# EAGLE design UV BOX (EAGLE 9.6.2)

## Sheet 1 of 6: Power Supply Unit
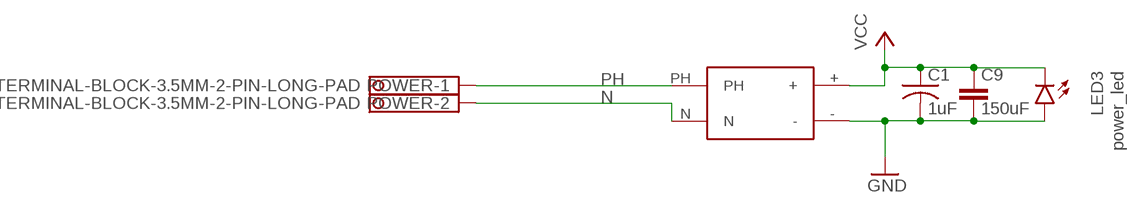
[diagram p0: schematic, sheet 1]

### Parts
C1  1uF  C-USC1206K  [C1206K]
C9  150uF  C5/5  [C5B5]
LED3  power_led  LEDCHIPLED_1206  [CHIPLED_1206]
POWER  TERMINAL-BLOCK-3.5MM-2-PIN-LONG-PAD  [TERMINAL-BLOCK-2-PIN-3.5MM-LONG-PAD]
U2  AC/DCCONVERTER  [ACDC]

### Nets
GND: C1.2 C9.2 LED3.A U2.- ; also sheet 2,3,4,5,6
N: POWER.2 U2.N ; also sheet 5
PH: POWER.1 U2.PH ; also sheet 5
VCC: C1.1 C9.1 LED3.C U2.+ ; also sheet 2,3,4,5,6

## Sheet 2 of 6: Indication LEDs
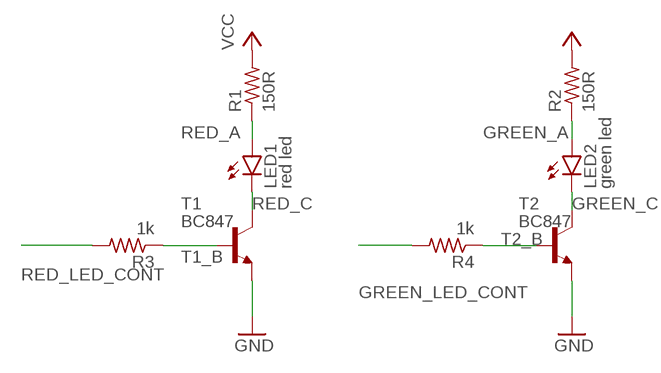
[diagram p1: schematic, sheet 2]

### Parts
LED1  red led  LEDCHIPLED_1206  [CHIPLED_1206]
LED2  green led  LEDCHIPLED_1206  [CHIPLED_1206]
R1  150R  R-US_R1206  [R1206]
R2  150R  R-US_R1206  [R1206]
R3  1k  R-US_R1206  [R1206]
R4  1k  R-US_R1206  [R1206]
T1  BC847  [SOT23]
T2  BC847  [SOT23]

### Nets
GND: T1.2(E) T2.2(E) ; also sheet 1,3,4,5,6
GREEN_A: LED2.A R2.1
GREEN_C: LED2.C T2.3(C)
GREEN_LED_CONT: R4.2 ; also sheet 6
RED_A: LED1.A R1.1
RED_C: LED1.C T1.3(C)
RED_LED_CONT: R3.2 ; also sheet 6
T1_B: R3.1 T1.1(B)
T2_B: R4.1 T2.1(B)
VCC: R1.2 R2.2 ; also sheet 1,3,4,5,6

## Sheet 3 of 6: Hooter System
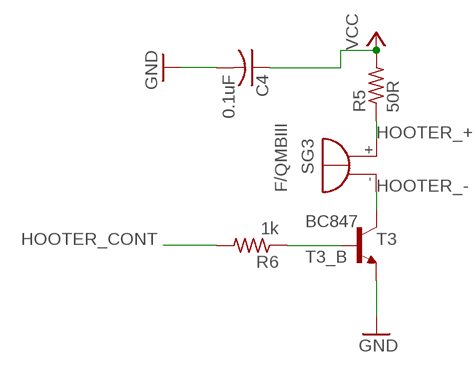
[diagram p2: schematic, sheet 3]

### Parts
C4  0.1uF  C-USC1206K  [C1206K]
R5  50R  R-US_R1206  [R1206]
R6  1k  R-US_R1206  [R1206]
SG3  F/QMBIII  [F/QMBIII]
T3  BC847  [SOT23]

### Nets
GND: C4.2 T3.2(E) ; also sheet 1,2,4,5,6
HOOTER_+: R5.1 SG3.+(-)
HOOTER_-: SG3.-(+) T3.3(C)
HOOTER_CONT: R6.2 ; also sheet 6
T3_B: R6.1 T3.1(B)
VCC: C4.1 R5.2 ; also sheet 1,2,4,5,6

## Sheet 4 of 6: Pushbutton
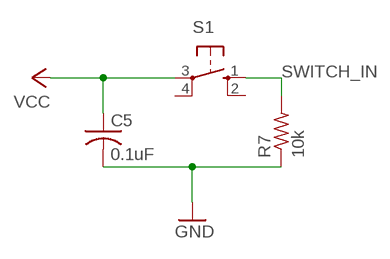
[diagram p3: schematic, sheet 4]

### Parts
C5  0.1uF  C-USC1206K  [C1206K]
R7  10k  R-US_R1206  [R1206]
S1  40-XX  [B3F-40XX]

### Nets
GND: C5.2 R7.1 ; also sheet 1,2,3,5,6
SWITCH_IN: R7.2 S1.1(S) ; also sheet 6
VCC: C5.1 S1.3(P) ; also sheet 1,2,3,5,6
Unconnected: S1.2(S1) S1.4(P1)

## Sheet 5 of 6: Relay and Limit Switch
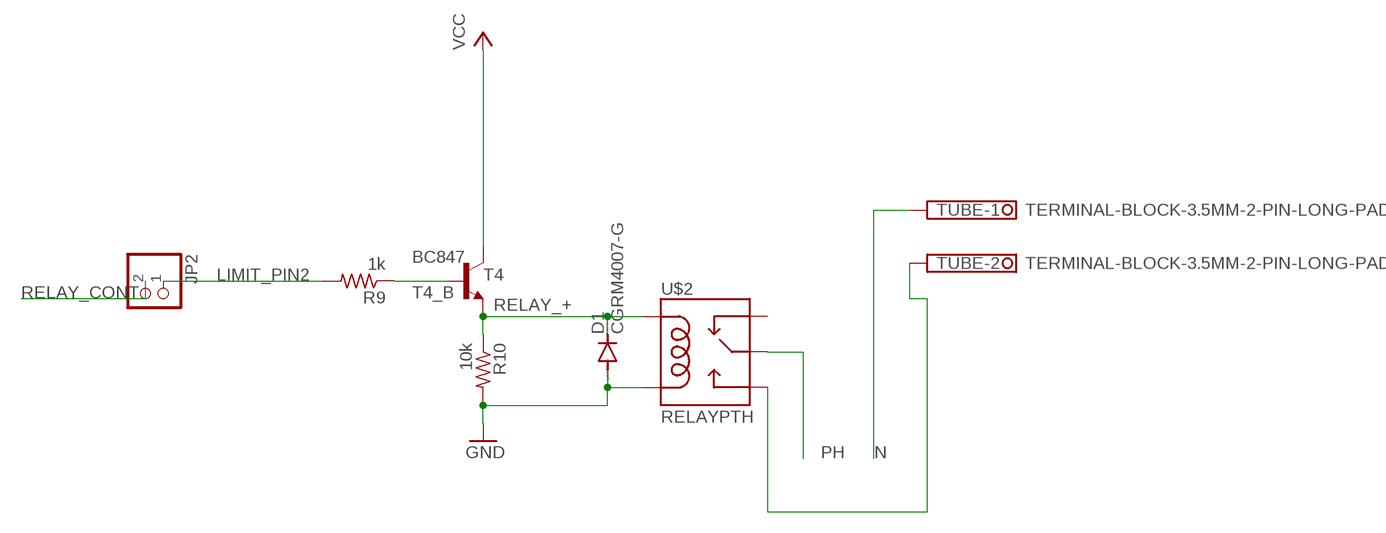
[diagram p4: schematic, sheet 5]

### Parts
D1  CGRM4007-G  [SOD-123_MINI-SMA]
JP2  PINHD-1X2  [1X02]
R9  1k  R-US_R1206  [R1206]
R10  10k  R-US_R1206  [R1206]
T4  BC847  [SOT23]
TUBE  TERMINAL-BLOCK-3.5MM-2-PIN-LONG-PAD  [TERMINAL-BLOCK-2-PIN-3.5MM-LONG-PAD]
U$2  RELAYPTH  [SRD-05VDC-SL-C]

### Nets
GND: D1.A R10.2 U$2.COIL0 ; also sheet 1,2,3,4,6
LIMIT_PIN2: JP2.1 R9.2
N: TUBE.1 ; also sheet 1
PH: U$2.SWCOMMON ; also sheet 1
RELAY_+: D1.C R10.1 T4.2(E) U$2.COIL1
RELAY_CONT: JP2.2 ; also sheet 6
T4_B: R9.1 T4.1(B)
TUBE_N: TUBE.2 U$2.SWOPEN
VCC: T4.3(C) ; also sheet 1,2,3,4,6
Unconnected: U$2.SWCLOSED(SWCLOSE)

## Sheet 6 of 6: controller
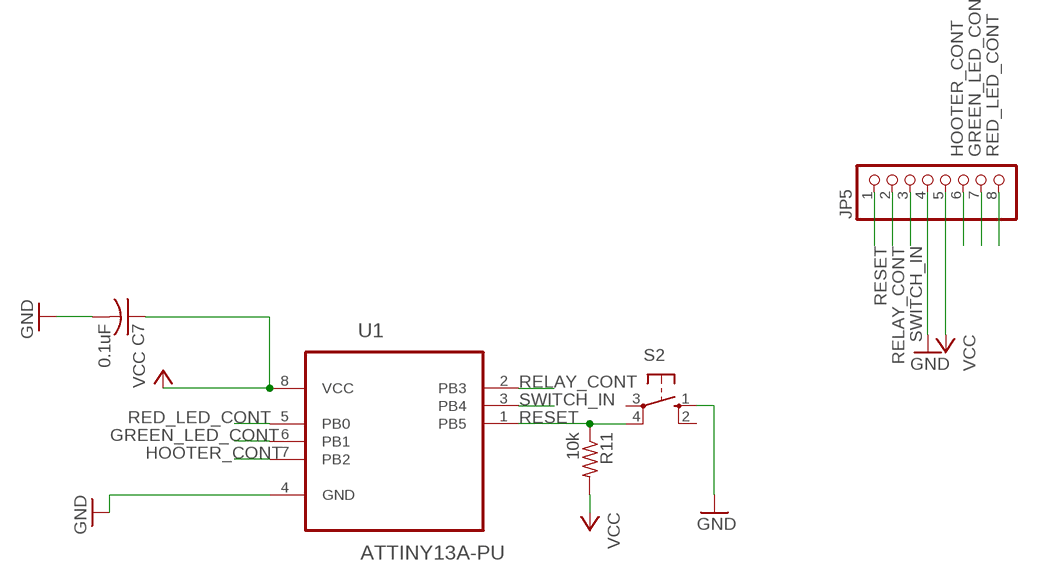
[diagram p5: schematic, sheet 6]

### Parts
C7  0.1uF  C-USC1206K  [C1206K]
JP5  PINHD-1X8  [1X08]
R11  10k  R-US_R1206  [R1206]
S2  10-XX  [B3F-10XX]
U1  ATTINY13A-PU  [DIP254P762X533-8]

### Nets
GND: C7.2 JP5.4 S2.1(S) U1.4(GND) ; also sheet 1,2,3,4,5
GREEN_LED_CONT: JP5.7 U1.6(PB1) ; also sheet 2
HOOTER_CONT: JP5.6 U1.7(PB2) ; also sheet 3
RED_LED_CONT: JP5.8 U1.5(PB0) ; also sheet 2
RELAY_CONT: JP5.2 U1.2(PB3) ; also sheet 5
RESET: JP5.1 R11.1 S2.4(P1) U1.1(PB5)
SWITCH_IN: JP5.3 U1.3(PB4) ; also sheet 4
VCC: C7.1 JP5.5 R11.2 U1.8(VCC) ; also sheet 1,2,3,4,5
Unconnected: S2.2(S1) S2.3(P)

## Library data of the parts
C1 C4 C5 C7 = rcl:C-US: CAPACITOR, American symbol; SPICEPREFIX: C
C9 = capacitor-wima:C: CAPACITOR naming: grid - package width
D1 = diode:CGRM400*-G: Molded plasitc,JEDEC SOD-123/Mini SMA Source: Comchip CGRM4001-G.pdf
JP2 = pinhead:PINHD-1X2: PIN HEADER
JP5 = pinhead:PINHD-1X8: PIN HEADER
LED1-LED3 = led:LED: LED OSRAM: - CHIPLED LG R971, LG N971, LY N971, LG Q971, LY Q971, LO R971, LY R971 LH N974, LH R974 LS Q976, LO Q976, LY Q976 LO Q996 - Hyper CHIPLED LW Q18S LB Q993, LB Q99A, LB R99A - SideLED LS A670, LO A670, LY A670, LG A670, LP A670 LB A673, LV A673, LT A673, LW A673 LH A674 LY A675 LS A676, LA A676, LO A676, LY A676, LW A676 LS A679, LY A679, LG A679 - Hyper Micro SIDELED® LS Y876, LA Y876, LO Y876, LY Y876 LT Y87S - SmartLED LW L88C, LW L88S LB L89C, LB L89S, LG L890 LS L89K, LO L89K, LY L89K LS L896, LA L896, LO L896, LY L896 - TOPLED LS T670, LO T670, LY T670, LG T670, LP T670 LSG T670, LSP T670, LSY T670, LOP T670, LYG T670 LG T671, LOG T671, LSG T671 LB T673, LV T673, LT T673, LW T673 LH T674 LS T676, LA T676, LO T676, LY T676, LB T676, LH T676, LSB T676, LW T676 LB T67C, LV T67C, LT T67C, LS T67K, LO T67K, LY T67K, LW E67C LS E67B, LA E67B, LO E67B, LY E67B, LB E67C, LV E67C, LT E67C LW T67C LS T679, LY T679, LG T679 LS T770, LO T770, LY T770, LG T770, LP T770 LB T773, LV T773, LT T773, LW T773 LH T774 LS E675, LA E675, LY E675, LS T675 LS T776, LA T776, LO T776, LY T776, LB T776 LHGB T686 LT T68C, LB T68C - Hyper Mini TOPLED® LB M676 - Mini TOPLED Santana® LG M470 LS M47K, LO M47K, LY M47K Source: http://www.osram.convergy.de LUXEON: - LUMILED® LXK2-PW12-R00, LXK2-PW12-S00, LXK2-PW14-U00, LXK2-PW14-V00 LXK2-PM12-R00, LXK2-PM12-S00, LXK2-PM14-U00 LXK2-PE12-Q00, LXK2-PE12-R00, LXK2-PE12-S00, LXK2-PE14-T00, LXK2-PE14-U00 LXK2-PB12-K00, LXK2-PB12-L00, LXK2-PB12-M00, LXK2-PB14-N00, LXK2-PB14-P00, LXK2-PB14-Q00 LXK2-PR12-L00, LXK2-PR12-M00, LXK2-PR14-Q00, LXK2-PR14-R00 LXK2-PD12-Q00, LXK2-PD12-R00, LXK2-PD12-S00 LXK2-PH12-R00, LXK2-PH12-S00 LXK2-PL12-P00, LXK2-PL12-Q00, LXK2-PL12-R00 Source: www.luxeon.com KINGBRIGHT: KA-3528ASYC Source: www.kingbright.com
POWER TUBE = Rembrandt Electronics - Terminal Block 3-5mm v1-0:TERMINAL-BLOCK-3.5MM-2-PIN: Terminal Block 3.5mm Pitch: 3,5 mm Number of pins: 2 Created by Rembrandt Electronics www.rembrandtelectronics.com
R1-R7 R9-R11 = rcl:R-US_: RESISTOR, American symbol; SPICEPREFIX: R
S1 = switch-omron:40-XX: OMRON SWITCH; MF: OMRON COMPONENTS USA; MPN: B3F-4000; OC_FARNELL: 176434; OC_NEWARK: 36K3105
S2 = switch-omron:10-XX: OMRON SWITCH; MPN: B3F-1000; OC_FARNELL: 176432; OC_NEWARK: 36M3542
SG3 = buzzer:F/QMBIII: BUZZER Source: Buerklin; OC_FARNELL: unknown; OC_NEWARK: unknown
T1-T4 = transistor:BC847: NPN TRANSISTOR
U1 = ATTINY13A-PU:ATTINY13A-PU: 8-bit Microcontroller with 1K Bytes In-System Programmable Flash Check prices <https://pricing.snapeda.com/parts/ATTINY13A-PU/Microchip/view-part?ref=eda>; AVAILABILITY: Good; DESCRIPTION: AVR AVR® ATtiny Microcontroller IC 8-Bit 20MHz 1KB (512 x 16) FLASH 8-PDIP; MF: Microchip; MP: ATTINY13A-PU; PACKAGE: PDIP-8 Microchip; PRICE: None; PURCHASE-URL: https://pricing.snapeda.com/search/part/ATTINY13A-PU/?ref=eda
U2 = ACDC_5V:AC/DCCONVERTER
U$2 = SRD-05VDC-SL-C:RELAY: SPDT relay (COM-00101)

## Net classes
0 default: width 0.152 mm, clearance 0.152 mm

## Board
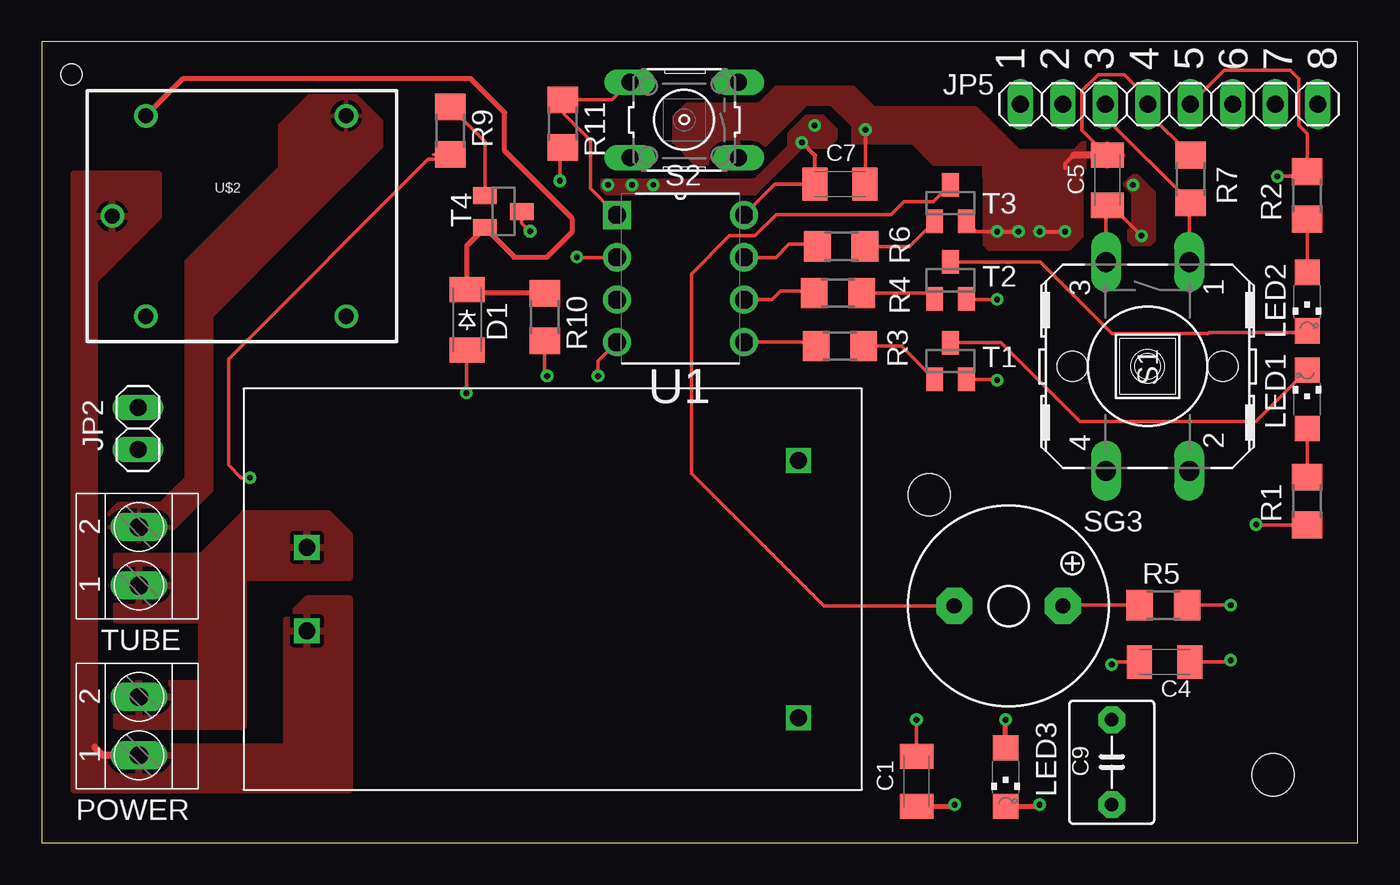
[diagram p6: board, top side]
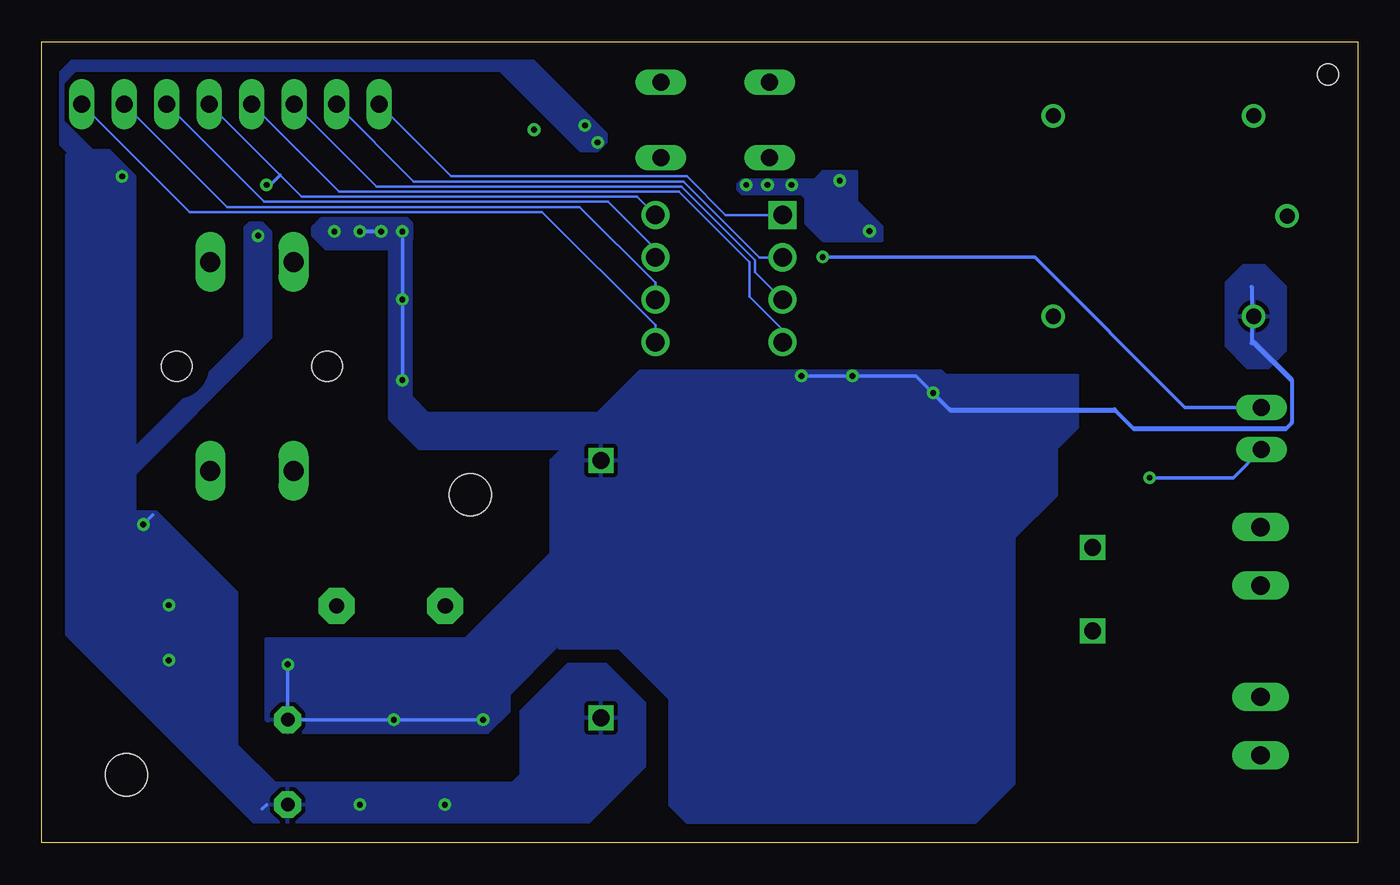
[diagram p7: board, bottom side, seen from below]

Size 78.72 x 47.93 mm. Coordinates in mm from the lower left corner, seen from the top.
Outline: 0,0 78.72,0 78.72,47.93 0,47.93 0,0
Copper layers (1*16): Top 0.035mm / dielectric 1.5mm / Bottom 0.035mm
Design rules "default *": minimum track width 6mil, minimum drill 0.35mm, track to track 6mil, track to pad 6mil, pad to pad 6mil, via to via 12mil, smd to smd 6mil, copper to edge 40mil, drill to drill 6mil, minimum pad ring 10mil, minimum via ring 8mil, stop-mask expansion 4mil, vias tented up to drill 0mil, thermal gap 10mil
Holes 2.51 mm at 53.09,20.83 73.66,4.06
Holes 1.27 mm at 1.78,45.97

### Footprints (pad centres in the part's own frame; a part is rotated, then mirrored left to right if it is on the bottom)
C1206K = smd 1.5 x 2: 1 -1.5,0; 2 1.5,0
C5B5 = drill 0.813 pad 1.6 octagon: 1 -2.54,0; 2 2.54,0
SOD-123_MINI-SMA = smd 1.5 x 2.1: A 1.8,0; C -1.8,0
1X02 = drill 1.016 long: 1 -1.27,0; 2 1.27,0
1X08 = drill 1.016 long: 1 -8.89,0; 2 -6.35,0; 3 -3.81,0; 4 -1.27,0; 5 1.27,0; 6 3.81,0; 7 6.35,0; 8 8.89,0
CHIPLED_1206 = smd 1.5 x 1.5: A 0,-1.75; C 0,1.75
TERMINAL-BLOCK-2-PIN-3.5MM-LONG-PAD = drill 1.1 pad 1.7 long: 1 -1.75,-0.1; 2 1.75,-0.1
R1206 = smd 1.6 x 1.803: 1 -1.422,0; 2 1.422,0
B3F-40XX = drill 1.194 long: 1 -6.248,2.489; 2 6.248,2.489; 3 -6.248,-2.489; 4 6.248,-2.489 | hole 1.803: 0,-4.496; 0,4.496
B3F-10XX = drill 1.016 long: 1 -3.251,2.261; 2 3.251,2.261; 3 -3.251,-2.261; 4 3.251,-2.261
F/QMBIII = drill 0.914 pad 2.159 octagon: + 3.251,0; - -3.251,0
SOT23 = smd 1 x 1.4: 1 -0.95,-1.1; 2 0.95,-1.1; 3 0,1.1
DIP254P762X533-8 = drill 1.118 square: 1 -7.62,7.62 | drill 1.118: 2 -7.62,5.08; 3 -7.62,2.54; 4 -7.62,0; 5 0,0; 6 0,2.54; 7 0,5.08; 8 0,7.62
ACDC = drill 1 square: + 33.2,4.3; - 33.2,19.7; N 3.8,14.5; PH 3.8,9.5
SRD-05VDC-SL-C = drill 0.9: COIL0 -5.39,-6.12; COIL1 -5.39,5.88; SWCLOSED 6.61,-6.12; SWCOMMON -7.39,-0.12; SWOPEN 6.61,5.88

### Placement (x,y rotation side)
C1  52.32,3.68 90 top
C4  67.17,10.82 180 top
C5  63.74,39.64 90 top
C7  47.75,39.41 0 top
C9  64.01,4.83 90 top
D1  25.44,31.29 270 top
JP2  5.76,24.79 90 top
JP5  67.44,44.2 0 top
LED1  75.69,26.54 0 top
LED2  75.69,32.38 180 top
LED3  57.66,3.94 180 top
POWER  5.71,6.99 90 top
R1  75.69,20.45 270 top
R2  75.69,38.73 90 top
R3  47.75,29.72 180 top
R4  47.62,32.89 180 top
R5  67.09,14.22 0 top
R6  47.82,35.69 180 top
R7  68.73,39.72 270 top
R9  24.44,42.61 270 top
R10  30.09,31.46 270 top
R11  31.17,43.03 270 top
S1  66.15,28.51 270 top
S2  38.43,43.26 180 top
SG3  57.84,14.17 0 top
T1  54.36,28.83 0 top
T2  54.36,33.66 0 top
T3  54.36,38.28 0 top
T4  27.61,37.77 270 top
TUBE  5.71,17.14 90 top
U1  42.02,29.95 0 top
U2  12.06,3.17 0 top
U$2  11.61,37.62 0 top

### Tracks (layer width: path | path; a pad name or v marks a point on that pad's centre or on a via)
GND  (via drill 0.35)
  Top 0.203: C1.2 v52.32,7.37 | v64.01,10.67 64.16,10.82 C4.2 | T1.2 57.11,27.73 v57.15,27.69 | v57.15,32.51 55.35,32.51 T2.2 | T3.2 55.91,36.58 v57.15,36.58 | v49.28,42.67 49.28,39.44 C7.2 | R7.1 66.17,43.7 JP5.4 66.17,44.58 64.77,45.97 63.21,45.97 62.23,45 62.23,42.65 C5.2 | R10.2 30.09,28.08 v30.23,27.94 | v33.27,27.94 33.27,28.83 U1.4 | v25.4,26.92 25.4,29.45 D1.A
  Top 0.254: v57.15,36.58 v58.42,36.58 | v59.69,36.58 v61.21,36.58 | 61.72,41.14 61.21,40.63 61.21,40.39
  Top 0.305: LED3.A v57.66,7.37
  Top 0.406: C5.2 61.72,41.14
  Bottom 0.152: U1.4 34.4,30.71 36.37,32.69 36.37,34.75 40.59,38.96 60.94,38.96 JP5.4
  Bottom 0.203: v52.32,7.37 v57.66,7.37 63.25,7.37 64.01,8.13 v64.01,10.67 | v57.15,27.69 v57.15,32.51 v57.15,36.58 | v33.27,27.94 v30.23,27.94 26.42,27.94 v25.4,26.92
  Bottom 0.254: 3.96,27.69 3.96,25.12 4.31,24.77 | 24.38,25.91 v25.4,26.92 | 13.39,24.77 14.53,25.91 | 6.35,33.27 6.35,29.9 | v58.42,36.58 v59.69,36.58
  Bottom 0.305: 24.38,25.91 14.53,25.91 | 4.31,24.77 13.39,24.77 | 3.96,27.69 6.22,29.95
  pour Bottom: 7.87,32.26 7.87,29.72 6.6,28.45 5.33,28.45 4.32,29.46 4.32,33.27 5.59,34.54 6.86,34.54 7.87,33.53
  pour Bottom: 16.76,27.94 24.64,27.94 24.89,28.19 42.93,28.19 48.26,22.86 48.26,12.19 47.75,11.68 44.2,11.68 41.15,8.64 41.15,2.29 40.13,1.27 22.86,1.27 20.57,3.56 20.57,18.29 18.03,20.83 18.03,23.62 16.76,24.89
  pour Bottom: 48.01,11.68 50.8,8.89 50.8,7.87 52.07,6.6 64.52,6.6 65.28,7.37 65.28,12.19 53.34,12.19 48.26,17.27 48.26,11.94
  pour Bottom: 45.21,25.65 55.63,25.65 56.64,26.67 56.64,36.83 56.9,37.08 57.4,37.08 57.91,36.58 57.91,25.4 56.13,23.62 47.24,23.62
  pour Top: 56.64,35.56 61.47,35.56 62.23,36.32 62.23,40.39 56.9,40.39 56.39,39.88 56.39,35.81
  pour Top: 56.39,39.88 56.39,41.15 56.64,41.4 61.72,41.4 62.23,40.89 62.23,40.39 61.72,39.88
  pour Top: 58.42,41.4 55.88,43.94 49.78,43.94 48.51,42.67 48.51,41.91 52.07,41.91 53.34,40.64 56.39,40.64 57.66,40.64
  pour Top: 48.51,42.93 47.24,44.2 45.72,44.2 42.93,41.4 42.93,40.64 39.12,40.64 37.85,41.91 37.85,43.43 38.61,44.2 42.93,44.2 43.94,45.21 48.51,45.21 49.78,43.94 48.77,42.93 48.77,42.67
  pour Bottom: 56.64,36.07 57.15,35.56 61.72,35.56 62.48,36.32 62.48,36.83 62.23,37.08 61.98,37.34 56.9,37.34 56.64,37.08
  pour Top: 61.98,40.39 64.77,40.39 64.77,41.91 62.23,41.91 61.72,41.4 61.72,40.64
GREEN_A
  Top 0.203: LED2.A R2.1
GREEN_C
  Top 0.203: T2.3 59.73,34.76 64.01,30.48 69.76,30.48 69.81,30.53 75.59,30.53 LED2.C
GREEN_LED_CONT
  Top 0.203: U1.6 43.67,32.49 44.2,33.02 46.08,33.02 R4.2
  Bottom 0.152: U1.6 42.02,33.51 46.56,38.05 67.64,38.05 JP5.7
HOOTER_+
  Top 0.203: R5.1 61.14,14.22 SG3.+
HOOTER_-
  Top 0.203: T3.3 53.33,38.35 51.56,38.35 50.8,37.59 43.94,37.59 42.67,36.32 41.15,36.32 38.86,34.04 38.86,22.1 46.79,14.17 SG3.-
HOOTER_CONT
  Top 0.203: U1.7 43.92,35.03 44.7,35.81 46.28,35.81 R6.2
  Bottom 0.152: U1.7 42.02,35.54 44.83,38.35 65.41,38.35 JP5.6
LIMIT_PIN2  (via drill 0.35)
  Top 0.203: 23.43,41.19 R9.2 24.14,40.89 23.11,40.89 11.18,28.96 11.18,22.61 11.94,21.84 v12.45,21.84
  Bottom 0.203: v12.45,21.84 7.44,21.84 JP2.1
N
  pour Top: 4.45,6.99 12.06,6.99 12.06,15.88 18.41,15.88 18.41,18.41 17.14,19.68 12.06,19.68 9.53,17.14 9.53,9.53 4.45,9.53
  pour Top: 9.53,17.14 4.45,17.14 4.45,13.34 9.53,13.34
PH
  Top 0.406: POWER.1 3.65,5.24 3.17,5.71
  pour Top: 4.45,3.17 18.41,3.17 18.41,14.61 15.88,14.61 14.61,13.34 14.61,5.71 4.45,5.71
  pour Top: 4.45,4.45 3.17,5.71 3.17,33.66 6.99,37.47 6.99,40.01 1.91,40.01 1.91,3.17 4.45,3.17
RED_A
  Top 0.203: R1.1 LED1.A
RED_C
  Top 0.203: T1.3 57.38,29.93 62.09,25.22 72.62,25.22 LED1.C
RED_LED_CONT
  Top 0.203: U1.5 46.1,29.95 R3.2
  Bottom 0.152: U1.5 42.02,30.97 48.8,37.74 69.88,37.74 JP5.8
RELAY_+
  Top 0.305: R10.1 25.65,32.88 D1.C 25.44,35.75 T4.2 28.19,35.14 28.19,35.05 30.23,35.05 31.75,36.58 31.75,37.34 27.69,41.4 27.69,43.69 25.65,45.72 8.44,45.72 U$2.COIL1
RELAY_CONT  (via drill 0.35)
  Top 0.203: U1.2 32.02,35.03 v32,35.05
  Bottom 0.152: U1.2 35.79,35.03 40.34,39.57 56.46,39.57 JP5.2
  Bottom 0.203: v32,35.05 19.32,35.05 10.33,26.06 JP2.2
RESET
  Top 0.203: R11.1 31.24,44.45 | 31.24,44.45 34.12,44.45 S2.4 | U1.1 32.83,39.14 32.83,42.01 31.24,43.6 31.24,44.45
  Bottom 0.152: U1.1 37.83,37.57 40.13,39.88 54.23,39.88 JP5.1
SWITCH_IN
  Top 0.203: S1.1 68.64,38.21 R7.2 63.63,43.39 JP5.3
  Bottom 0.152: U1.3 36.07,34.16 36.07,34.88 40.46,39.27 58.7,39.27 JP5.3
T1_B
  Top 0.203: R3.1 51.42,29.72 T1.1
T2_B
  Top 0.203: R4.1 53.07,32.89 T2.1
T3_B
  Top 0.203: R6.1 51.92,35.69 T3.1
T4_B
  Top 0.203: R9.1 26.52,41.96 T4.1
TUBE_N
  pour Top: 16.26,44.7 18.8,44.7 20.32,43.18 20.32,41.66 15.49,36.83 10.16,31.5 10.16,21.08 7.11,18.03 4.57,18.03 4.06,18.54 4.06,19.81 4.57,20.32 6.1,20.32 7.11,20.32 7.87,21.08 8.64,21.84 8.64,34.8 14.22,40.39 14.22,42.93 16,44.7
VCC  (via drill 0.35)
  Top 0.203: S1.3 63.66,38.06 C5.1 | v71.12,14.22 R5.2 | C4.1 71.02,10.82 v71.12,10.92 | 57.81,2.03 LED3.C | 52.43,2.29 C1.1 | R1.2 72.67,19.02 v72.64,19.05 | v65.79,36.32 63.97,38.14 C5.1 | JP5.5 70.74,46.23 74.68,46.23 75.18,45.72 75.18,42.93 75.69,42.42 R2.2 75.41,39.88 v73.91,39.88 | C7.1 43.86,39.41 U1.8 | T4.3 28.71,37.09 v29.21,36.6 | v30.99,39.62 30.99,41.43 R11.2 | C5.1 63.74,38.34
  Top 0.254: C7.1 46.25,41.12 v45.47,41.91
  Top 0.305: C1.1 54.51,2.18 v54.61,2.29 | LED3.C 59.59,2.19 v59.69,2.29
  Bottom 0.152: U1.8 43.11,38.66 63.17,38.66 64.45,39.94 JP5.5
  Bottom 0.203: 65.28,2.29 65.53,2.03 | v72.64,19.05 72.07,19.62 | v65.28,39.37 65.02,39.37 64.45,39.94
  other vias: 36.58,39.37 35.31,39.37 33.87,39.37 46.23,42.93
  pour Bottom: 74.68,41.4 76.96,41.4 77.22,41.15 77.22,12.45 66.04,1.27 45.97,1.27 42.67,4.57 42.67,8.38 44.96,10.67 47.24,10.67 50.04,7.87 50.04,4.06 50.55,3.56 64.77,3.56 67.06,5.84 67.06,14.99 71.88,19.81 73.15,19.81 73.15,39.88
  pour Bottom: 65.02,30.23 65.02,36.58 65.53,37.08 66.29,37.08 66.55,36.83 66.55,30.23 73.91,22.86 73.91,21.34
  pour Bottom: 77.22,41.4 77.98,42.16 77.98,45.72 76.45,47.24 49.78,47.24 44.96,42.42 44.96,41.91 45.47,41.4 46.48,41.4 51.31,46.23 76.71,46.23 77.47,45.47 77.47,43.18 75.69,41.4
  pour Bottom: 28.45,36.83 29.97,38.35 29.97,40.13 32,40.13 32.51,39.62 36.83,39.62 37.08,39.37 37.08,39.12 36.83,38.86 33.27,38.86 33.02,38.61 33.02,37.85 33.02,37.08 32,36.07 28.45,36.07
  pour Top: 36.07,39.62 36.07,39.12 36.32,38.86 42.67,38.86 45.47,41.66 46.99,41.66 47.5,42.16 47.5,42.67 46.74,43.43 45.72,43.43 44.7,42.42 44.7,41.66 42.67,39.62
  pour Top: 36.07,39.62 33.53,39.62 33.53,39.12 33.78,38.86 36.07,38.86
  pour Top: 65.02,36.07 65.28,35.81 66.29,35.81 66.55,36.07 66.55,36.32 66.55,38.86 65.53,39.88 65.28,39.88 64.77,39.37 65.28,38.86 65.28,36.83 65.02,36.58

### Text on the board
tNames: 1 / 2 / 3 / 4 / 5 / 6 / 7 / 8